# Altium schematic sheet Flash_Memory.SchDoc
size A4
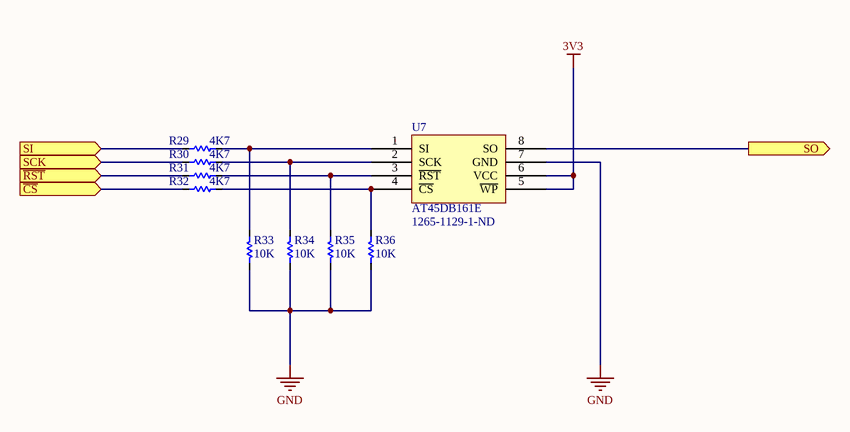
[diagram p0: Flash_Memory.SchDoc]

## Parts
R29  4K7  [R0603(1608)]
R30  4K7  [R0603(1608)]
R31  4K7  [R0603(1608)]
R32  4K7  [R0603(1608)]
R33  10K  [R0603(1608)]
R34  10K  [R0603(1608)]
R35  10K  [R0603(1608)]
R36  10K  [R0603(1608)]
U7  AT45DB161E  Supplier Part Number 1: 1265-1129-1-ND  [8-UDFN 5x6]

## Ports
SCK (in), SI (in), SO (out), ~{CS} (in), ~{RST} (in)

## Nets
3V3: U7.5(~{WP}) U7.6(VCC)
GND: R33.2 R34.2 R35.2 R36.2 U7.7(GND)
~{CS}: R32.2 ; port ~{CS}
~{RST}: R31.2 ; port ~{RST}
SCK: R30.2 ; port SCK
SI: R29.2 ; port SI
SO: U7.8(SO) ; port SO
NetR29_1: R29.1 R33.1 U7.1(SI)
NetR30_1: R30.1 R34.1 U7.2(SCK)
NetR31_1: R31.1 R35.1 U7.3(~{RST})
NetR32_1: R32.1 R36.1 U7.4(~{CS})

## Library data of the parts
R29-R36 = R: Resistor
U7 = AT45DB161E: SPI Flash Memory; Manufacturer: Adesto Technologies; Manufacturer Part Number: AT45DB161E-MHD2B-T; Memory Type: DataFLASH; Memory Size: 16M (4096 pages x 512 bytes); Speed: 85MHz; Interface: SPI, RapidS; Voltage - Supply: 2.5 V ~ 3.6 V; Supplier 1: Digi-Key; RoHS: RoHS Compliant; Category: Integrated Circuits (ICs); Stock 1: 6995; Pricing 1: 1=2.67, 10=2.398, 25=2.36, 50=2.353, 100=2.1022, 250=2.03436, 500=2.0263, 1000=1.88715, 2500=1.8561 (USD); Packaging: Cut Tape (CT); Format - Memory: FLASH; Operating Temperature: -40°C ~ 85°C; Package / Case: 8-UDFN Exposed Pad; Supplier Device Package: 8-UDFN (5x6); ComponentLink1URL: http://www.adestotech.com/wp-content/uploads/doc8782.pdf; ComponentLink1Description: http://www.adestotech.com/wp-content/uploads/doc8782.pdf